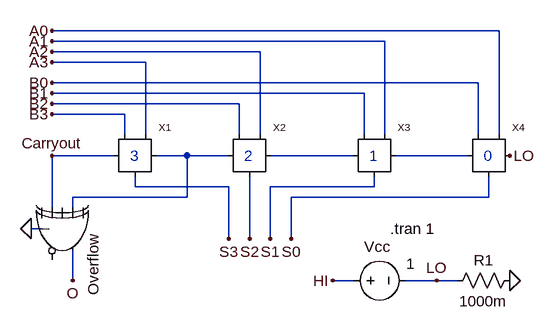
[diagram p0: schematic four_bit_adder.asc]
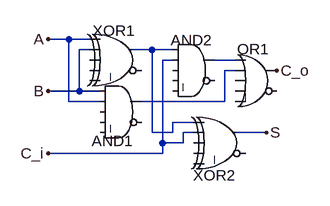
[diagram p1: sub-circuit one_bit_adder.asc]
four_bit_adder.asc, the LTspice schematic file:
Version 4
SHEET 1 908 680
WIRE 592 -80 -96 -80
WIRE 416 -64 -96 -64
WIRE 224 -48 -96 -48
WIRE 48 -32 -96 -32
WIRE 560 0 -96 0
WIRE 384 16 -96 16
WIRE 192 32 -96 32
WIRE 16 48 -96 48
WIRE 16 80 16 48
WIRE 48 80 48 -32
WIRE 192 80 192 32
WIRE 224 80 224 -48
WIRE 384 80 384 16
WIRE 416 80 416 -64
WIRE 560 80 560 0
WIRE 592 80 592 -80
WIRE 0 112 -96 112
WIRE 112 112 64 112
WIRE 176 112 112 112
WIRE 368 112 240 112
WIRE 544 112 432 112
WIRE 32 160 32 144
WIRE 176 160 32 160
WIRE 400 160 400 144
WIRE 400 160 240 160
WIRE 112 176 112 112
WIRE 112 176 -64 176
WIRE 576 176 576 144
WIRE 576 176 272 176
WIRE -96 192 -96 112
WIRE -64 192 -64 176
WIRE -112 224 -128 224
WIRE 176 240 176 160
WIRE 208 240 208 144
WIRE 240 240 240 160
WIRE 272 240 272 176
WIRE -64 304 -64 256
WIRE 368 304 336 304
WIRE 496 304 448 304
WIRE 528 304 496 304
FLAG -64 304 O
FLAG 336 304 HI
FLAG -96 112 Carryout
FLAG 176 240 S3
FLAG 208 240 S2
FLAG 240 240 S1
FLAG 272 240 S0
FLAG 608 304 0
FLAG 608 112 LO
FLAG 496 304 LO
FLAG -128 224 0
FLAG -96 -80 A0
FLAG -96 -64 A1
FLAG -96 -48 A2
FLAG -96 -32 A3
FLAG -96 0 B0
FLAG -96 16 B1
FLAG -96 32 B2
FLAG -96 48 B3
SYMBOL Digital\\xor -16 240 R90
SYMATTR InstName Overflow
SYMBOL voltage 352 304 R270
WINDOW 123 0 0 Left 2
WINDOW 39 0 0 Left 2
WINDOW 0 52 32 VRight 2
WINDOW 3 26 97 VRight 2
SYMATTR InstName Vcc
SYMATTR Value 1
SYMBOL res 512 320 R270
WINDOW 0 32 56 VTop 2
WINDOW 3 0 56 VBottom 2
SYMATTR InstName R1
SYMATTR Value 1000m
SYMBOL one_bit_adder 32 112 R0
SYMATTR InstName X1
SYMBOL one_bit_adder 208 112 R0
SYMATTR InstName X2
SYMBOL one_bit_adder 400 112 R0
SYMATTR InstName X3
SYMBOL one_bit_adder 576 112 R0
SYMATTR InstName X4
TEXT 424 224 Left 2 !.tran 1
TEXT 568 112 Left 2 ;0
TEXT 392 112 Left 2 ;1
TEXT 200 112 Left 2 ;2
TEXT 24 112 Left 2 ;3

one_bit_adder.asc, the sub-circuit schematic file:
Version 4
SHEET 1 880 680
WIRE 48 64 16 64
WIRE 80 64 48 64
WIRE 80 80 64 80
WIRE 176 80 144 80
WIRE 208 80 176 80
WIRE 208 96 192 96
WIRE 304 96 272 96
WIRE 304 112 288 112
WIRE 64 144 64 80
WIRE 64 144 16 144
WIRE 96 144 64 144
WIRE 48 160 48 64
WIRE 96 160 48 160
WIRE 288 160 288 112
WIRE 288 160 160 160
WIRE 240 192 208 192
WIRE 176 208 176 80
WIRE 208 208 208 192
WIRE 208 208 176 208
WIRE 240 208 224 208
WIRE 352 208 304 208
WIRE 192 224 192 96
WIRE 224 224 224 208
WIRE 224 224 192 224
WIRE 192 240 192 224
WIRE 192 240 16 240
FLAG 16 64 A
FLAG 16 144 B
FLAG 16 240 C_i
FLAG 352 208 S
FLAG 368 112 C_o
SYMBOL Digital\\xor 128 32 R0
WINDOW 0 -43 19 Left 2
SYMATTR InstName XOR1
SYMBOL Digital\\and 128 112 R0
WINDOW 0 -45 109 Left 2
SYMATTR InstName AND1
SYMBOL Digital\\and 240 48 R0
WINDOW 0 -35 17 Left 2
SYMATTR InstName AND2
SYMBOL Digital\\xor 288 160 R0
WINDOW 0 -49 114 Left 2
SYMATTR InstName XOR2
SYMBOL Digital\\or 336 64 R0
WINDOW 0 -29 15 Left 2
SYMATTR InstName OR1

The netlist it stands for:
* four_bit_adder.asc
A§Overflow 0 N001 0 Carryout 0 0 O 0 XOR
Vcc HI LO 1
R1 LO 0 1000m
XX1 B3 A3 N001 Carryout S3 one_bit_adder
XX2 B2 A2 N002 N001 S2 one_bit_adder
XX3 B1 A1 N003 N002 S1 one_bit_adder
XX4 B0 A0 LO N003 S0 one_bit_adder

* block symbol definitions
.subckt one_bit_adder A B C_i C_o S
A§XOR1 A B 0 0 0 0 N001 0 XOR
AND1 B A 0 0 0 0 N003 0 AND
AND2 N001 C_i 0 0 0 0 N002 0 AND
A§XOR2 N001 C_i 0 0 0 0 S 0 XOR
A§OR1 N002 N003 0 0 0 0 C_o 0 OR
.ends one_bit_adder

.tran 1
* 0
* 1
* 2
* 3
.lib one_bit_adder.asc
.backanno
.end